# EAGLE design powersubpanel (EAGLE 8.2.1)
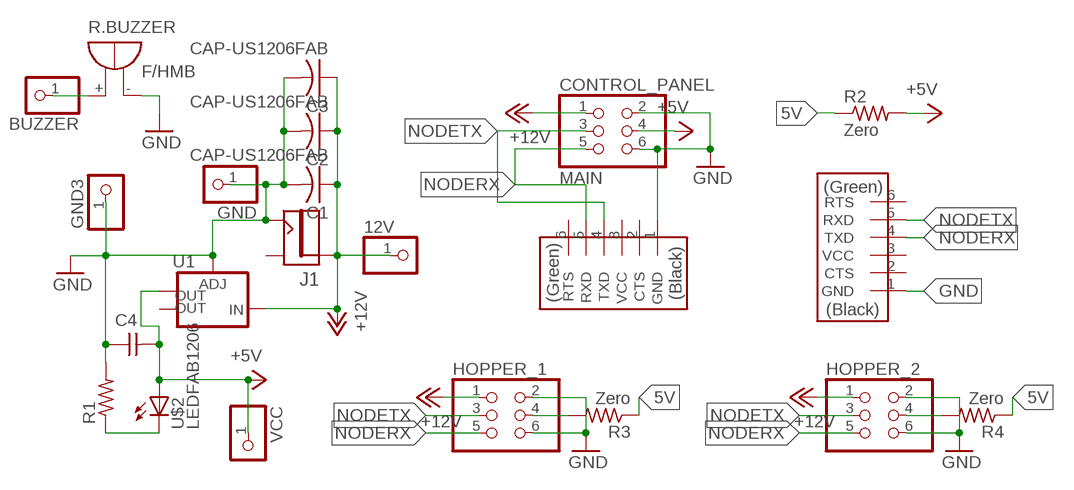
[diagram p0: schematic, sheet 1]

## Parts
12V  PINHD-1X1  [1X01]
BUZZER  PINHD-1X1  [1X01]
C1  CAP-US1206FAB  [C1206FAB]
C2  CAP-US1206FAB  [C1206FAB]
C3  CAP-US1206FAB  [C1206FAB]
C4  CAP-UNPOLARIZEDFAB  [C1206FAB]
CONTROL_PANEL  MAIN  PINHD-2X3-SMD  [2X03SMD]
FORCONTROLLER  FTDI-SMD-HEADER  [1X06SMD]
FORHOPPER  FTDI-SMD-HEADER  [1X06SMD]
GND  PINHD-1X1  [1X01]
GND3  PINHD-1X1  [1X01]
HOPPER_1  PINHD-2X3-SMD  [2X03SMD]
HOPPER_2  PINHD-2X3-SMD  [2X03SMD]
J1  JACK2.1MM  [JACK_2.1MM]
R1  RES-US1206FAB  [R1206FAB]
R2  Zero  RES-US1206FAB  [R1206FAB]
R3  Zero  RES-US1206FAB  [R1206FAB]
R4  Zero  RES-US1206FAB  [R1206FAB]
R.BUZZER  F/HMB  [F/HMB]
U1  V_REG_LM1117SOT223  [SOT223]
U$2  LEDFAB1206  [LED1206FAB]
VCC  PINHD-1X1  [1X01]

## Nets
5V: R2.1 R3.1 R4.1
5VA: HOPPER_1.4 R3.2
5VB: HOPPER_2.4 R4.2
+5V: C4.2 CONTROL_PANEL.4 R2.2 U1.4(OUT) U$2.1(A) VCC.1
+12V: 12V.1 C1.1 C2.1 C3.1 CONTROL_PANEL.1 HOPPER_1.1 HOPPER_2.1 J1.PIN U1.3(IN)
GND: C1.2 C2.2 C3.2 C4.1 CONTROL_PANEL.2 CONTROL_PANEL.6 FORCONTROLLER.1(GND) FORHOPPER.1(GND) GND3.1 GND.1 HOPPER_1.2 HOPPER_1.6 HOPPER_2.2 HOPPER_2.6 J1.CONTACT R1.2 R.BUZZER.- U1.1(ADJ)
N$1: BUZZER.1 R.BUZZER.+
N$2: R1.1 U$2.2(C)
NODERX: CONTROL_PANEL.5 FORCONTROLLER.5(RXD) FORHOPPER.4(TXD) HOPPER_1.5 HOPPER_2.5
NODETX: CONTROL_PANEL.3 FORCONTROLLER.4(TXD) FORHOPPER.5(RXD) HOPPER_1.3 HOPPER_2.3
Unconnected: FORCONTROLLER.2(CTS) FORCONTROLLER.3(VCC) FORCONTROLLER.6(RTS) FORHOPPER.2(CTS) FORHOPPER.3(VCC) FORHOPPER.6(RTS) J1.SHUNT U1.2(OUT)

## Library data of the parts
12V BUZZER GND GND3 VCC = pinhead:PINHD-1X1: PIN HEADER
C1-C3 = fab:CAP-US
C4 = fab:CAP-UNPOLARIZED
CONTROL_PANEL HOPPER_1 HOPPER_2 = fab:PINHD-2X3-SMD: PIN HEADER
FORCONTROLLER FORHOPPER = fab:FTDI-SMD-HEADER
J1 = fab:JACK
R1-R4 = fab:RES-US: Resistor (US Symbol) Variants with postfix FAB are widened to allow the routing of internal traces
R.BUZZER = buzzer:F/HMB: BUZZER Source: Buerklin; OC_FARNELL: unknown; OC_NEWARK: unknown
U1 = fab:V_REG_LM1117: Voltage Regulator LM1117 Standard adjustable voltage regulator but in SMD form. Spark Fun Electronics SKU : COM-00595; PROD_ID: VREG-08170
U$2 = fab:LED: LED

## Board
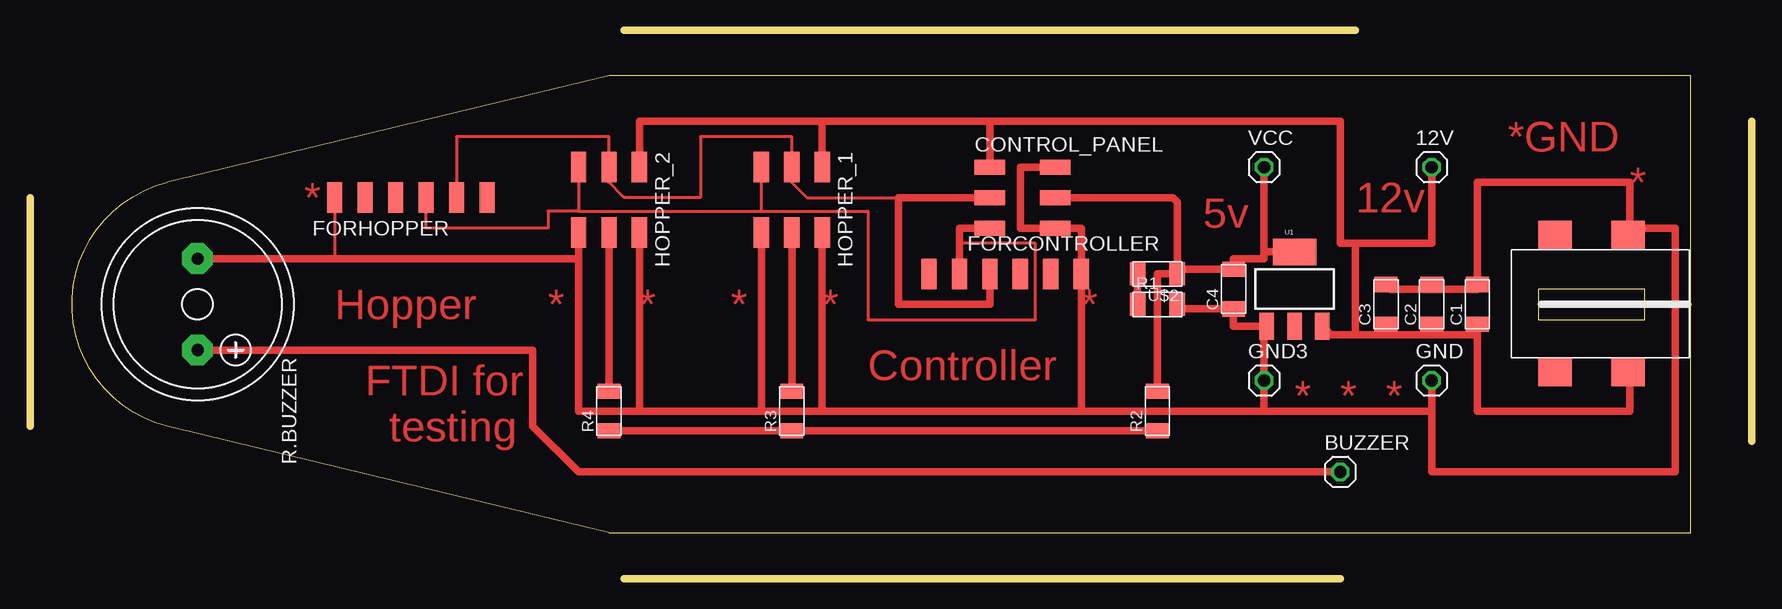
[diagram p1: board, top side]

Size 143.51 x 45.72 mm. Coordinates in mm from the lower left corner, seen from the top.
Outline: 0,31.75 0,12.7
Outline: 143.51,38.1 143.51,11.43
Outline: 110.49,45.72 49.53,45.72
Outline: 109.22,0 49.53,0
Outline: 48.26,3.81 138.43,3.81 138.43,41.91 48.26,41.91 11.43,33.02 arc152 11.43,12.7 48.26,3.81
Copper layers (1*16): Top 0.035mm / dielectric 1.5mm / Bottom 0.035mm
Design rules "default *": minimum track width 12mil, minimum drill 0.35mm, track to track 16mil, track to pad 16mil, pad to pad 16mil, via to via 16mil, smd to smd 16mil, copper to edge 40mil, drill to drill 6mil, minimum pad ring 10mil, minimum via ring 8mil, stop-mask expansion 4mil, vias tented up to drill 0mil, thermal gap 10mil

### Footprints (pad centres in the part's own frame; a part is rotated, then mirrored left to right if it is on the bottom)
1X01 = drill 1.016 octagon: 1 0,0
C1206FAB = smd 1.27 x 1.905: 1 -1.651,0; 2 1.651,0
2X03SMD = smd 2.54 x 1.27: 1 -2.54,2.54; 2 2.92,2.54; 3 -2.54,0; 4 2.92,0; 5 -2.54,-2.54; 6 2.92,-2.54
1X06SMD = smd 2.54 x 1.27: 1 0,6.35; 2 0,3.81; 3 0,1.27; 4 0,-1.27; 5 0,-3.81; 6 0,-6.35
JACK_2.1MM = smd 2.388 x 2.794: CONTACT 5.766,-2.413; PIN -5.639,-2.413; PIN1 -5.639,3.683; SHUNT 5.766,3.683
R1206FAB = smd 1.27 x 1.905: 1 -1.651,0; 2 1.651,0
F/HMB = drill 1.016 pad 2.54 octagon: + 3.81,0; - -3.81,0
SOT223 = smd 1.219 x 2.235: 1 -2.311,-3.099; 2 0,-3.099; 3 2.311,-3.099 | smd 3.6 x 2.2: 4 0,3.099
LED1206FAB = smd 1.27 x 1.905: 1 -1.651,0; 2 1.651,0

### Placement (x,y rotation side)
12V  116.84,34.29 0 top
BUZZER  109.22,8.89 0 top
C1  120.65,22.86 90 top
C2  116.84,22.86 90 top
C3  113.03,22.86 90 top
C4  100.33,24.13 90 top
CONTROL_PANEL  82.55,31.75 0 top
FORCONTROLLER  81.28,25.4 270 top
FORHOPPER  31.75,31.75 90 top
GND  116.84,16.51 0 top
GND3  102.87,16.51 0 top
HOPPER_1  63.5,31.75 270 top
HOPPER_2  48.26,31.75 270 top
J1  130.81,22.86 90 top
R1  93.98,22.86 0 top
R2  93.98,13.97 90 top
R3  63.5,13.97 90 top
R4  48.26,13.97 90 top
R.BUZZER  13.97,22.86 270 top
U1  105.41,24.13 0 top
U$2  93.98,25.4 180 top
VCC  102.87,34.29 0 top

### Tracks (layer width: path | path; a pad name or v marks a point on that pad's centre or on a via)
5V
  Top 0.61: R2.1 R3.1 R4.1
5VA
  Top 0.61: HOPPER_1.4 R3.2
5VB
  Top 0.61: HOPPER_2.4 R4.2
+5V
  Top 0.61: 102.87,27.23 102.87,26.67 100.33,26.67 C4.2 95.63,25.78 U$2.1 | 102.87,27.23 VCC.1 | U$2.1 95.63,31.37 95.25,31.75 CONTROL_PANEL.4 | U1.4 102.87,27.23 | U$2.1 93.98,25.4 R2.2 | U1.4 105.41,27.94 U1.4
+12V
  Top 0.61: 120.65,20.32 116.84,20.32 | 113.03,20.32 116.84,20.32 | 113.03,20.32 110.49,20.32 | 110.49,20.32 108.43,20.32 U1.3 | C1.1 120.65,20.32 | C2.1 116.84,20.32 | C3.1 113.03,20.32 | 12V.1 116.84,27.94 110.49,27.94 | 110.49,27.94 109.22,27.94 109.22,38.1 80.01,38.1 | 80.01,38.1 CONTROL_PANEL.1 | 80.01,38.1 66.04,38.1 | 66.04,38.1 HOPPER_1.1 | 66.04,38.1 50.8,38.1 HOPPER_2.1 | 110.49,20.32 110.49,27.94 | J1.PIN 133.35,17.22 133.35,13.97 120.65,13.97 120.65,20.32
GND
  Top 0.254: FORHOPPER.1 25.4,26.67
  Top 0.61: 116.84,13.97 102.87,13.97 | 102.87,13.97 GND3.1 102.87,20.8 U1.1 100.33,21.03 C4.1 95.63,22.48 R1.2 | 87.63,13.97 102.87,13.97 | 66.04,13.97 87.63,13.97 | 60.96,13.97 66.04,13.97 | 50.8,13.97 60.96,13.97 | 50.8,13.97 45.72,13.97 45.72,26.67 | CONTROL_PANEL.2 82.55,34.29 82.55,29.21 CONTROL_PANEL.6 87.63,29.21 FORCONTROLLER.1 87.63,13.97 | HOPPER_1.2 66.04,13.97 | HOPPER_1.6 60.96,13.97 | HOPPER_2.2 50.8,13.97 | 45.72,26.67 HOPPER_2.6 | R.BUZZER.- 25.4,26.67 45.72,26.67 | GND.1 116.84,13.97 | 116.84,24.13 120.65,24.13 C1.2 120.65,33.02 133.35,33.02 133.35,29.21 | 116.84,24.13 113.41,24.13 C3.2 | C2.2 116.84,24.13 | J1.CONTACT 133.35,28.63 133.35,29.21 | 133.35,29.21 137.16,29.21 137.16,8.89 116.84,8.89 116.84,13.97
N$1
  Top 0.61: R.BUZZER.+ 41.91,19.05 41.91,12.7 45.72,8.89 BUZZER.1
N$2
  Top 0.61: U$2.2 R1.1
NODERX
  Top 0.254: HOPPER_2.5 45.72,30.63 | 45.72,30.63 60.96,30.63 | 60.96,30.63 HOPPER_1.5 | 77.47,27.94 83.82,27.94 83.82,21.59 69.85,21.59 69.85,30.63 60.96,30.63 | 45.72,30.63 43.18,30.63 43.18,29.21 33.02,29.21 FORHOPPER.4
  Top 0.61: CONTROL_PANEL.5 77.47,29.21 77.47,27.94 FORCONTROLLER.5
NODETX
  Top 0.254: 72.39,31.75 64.77,31.75 63.57,32.95 arc-45 63.5,33.12 HOPPER_1.3 63.5,36.83 55.88,36.83 55.88,31.75 49.64,31.75 arc-45 49.46,31.82 48.26,33.02 HOPPER_2.3 48.26,36.83 35.56,36.83 FORHOPPER.5
  Top 0.61: CONTROL_PANEL.3 72.39,31.75 72.39,22.86 80.01,22.86 FORCONTROLLER.4

### Text on the board
Top: *GND | * | * | 12v | 5v | Hopper | * | * | * | * | * | Controller | * | * | * | FTDI for / testing